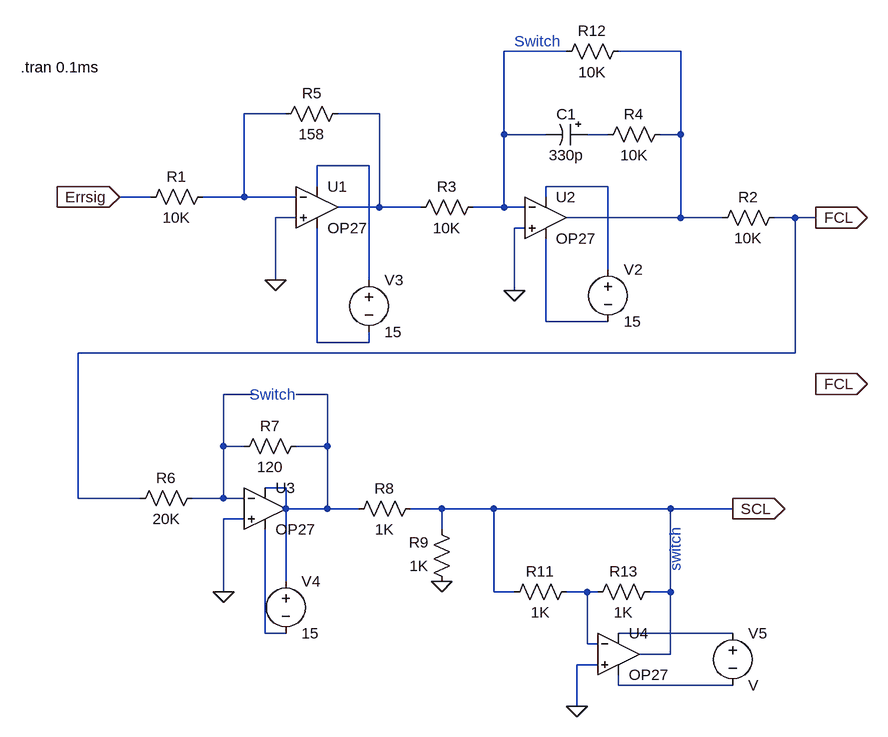
[diagram p0: schematic PID controller.asc]
PID controller.asc, the LTspice schematic file:
Version 4
SHEET 1 1340 1136
WIRE 768 96 672 96
WIRE 944 96 848 96
WIRE 336 192 272 192
WIRE 480 192 416 192
WIRE 672 224 672 96
WIRE 736 224 672 224
WIRE 832 224 800 224
WIRE 944 224 944 96
WIRE 944 224 912 224
WIRE 464 272 384 272
WIRE 384 304 384 272
WIRE 832 304 736 304
WIRE 128 320 80 320
WIRE 272 320 272 192
WIRE 272 320 208 320
WIRE 352 320 272 320
WIRE 736 320 736 304
WIRE 480 336 480 192
WIRE 480 336 416 336
WIRE 544 336 480 336
WIRE 672 336 672 224
WIRE 672 336 624 336
WIRE 704 336 672 336
WIRE 352 352 320 352
WIRE 944 352 944 224
WIRE 944 352 768 352
WIRE 1008 352 944 352
WIRE 1120 352 1088 352
WIRE 1152 352 1120 352
WIRE 704 368 688 368
WIRE 832 432 832 304
WIRE 320 448 320 352
WIRE 464 448 464 272
WIRE 688 464 688 368
WIRE 736 512 736 384
WIRE 832 512 736 512
WIRE 384 544 384 368
WIRE 464 544 464 528
WIRE 464 544 384 544
WIRE 1120 560 1120 352
WIRE 1120 560 16 560
WIRE 288 624 240 624
WIRE 400 624 352 624
WIRE 240 704 240 624
WIRE 272 704 240 704
WIRE 400 704 400 624
WIRE 400 704 352 704
WIRE 336 768 304 768
WIRE 16 784 16 560
WIRE 112 784 16 784
WIRE 240 784 240 704
WIRE 240 784 192 784
WIRE 272 784 240 784
WIRE 336 800 336 768
WIRE 400 800 400 704
WIRE 400 800 336 800
WIRE 448 800 400 800
WIRE 576 800 528 800
WIRE 656 800 576 800
WIRE 928 800 656 800
WIRE 1024 800 928 800
WIRE 272 816 240 816
WIRE 576 832 576 800
WIRE 336 912 336 800
WIRE 240 928 240 816
WIRE 656 928 656 800
WIRE 688 928 656 928
WIRE 800 928 768 928
WIRE 816 928 800 928
WIRE 928 928 928 800
WIRE 928 928 896 928
WIRE 304 992 304 832
WIRE 336 992 304 992
WIRE 1024 992 848 992
WIRE 800 1008 800 928
WIRE 816 1008 800 1008
WIRE 928 1024 928 928
WIRE 928 1024 880 1024
WIRE 816 1040 784 1040
WIRE 848 1072 848 1056
WIRE 1024 1072 848 1072
WIRE 784 1104 784 1040
FLAG 688 464 0
FLAG 320 448 0
FLAG 1152 352 FCL
IOPIN 1152 352 Out
FLAG 240 928 0
FLAG 784 1104 0
FLAG 1024 800 SCL
IOPIN 1024 800 Out
FLAG 576 912 0
FLAG 80 320 Errsig
IOPIN 80 320 In
FLAG 1152 608 FCL
IOPIN 1152 608 Out
SYMBOL res 112 336 R270
WINDOW 0 32 56 VTop 2
WINDOW 3 0 56 VBottom 2
SYMATTR InstName R1
SYMATTR Value 10K
SYMBOL polcap 800 208 R90
WINDOW 0 0 32 VBottom 2
WINDOW 3 32 32 VTop 2
SYMATTR InstName C1
SYMATTR Value 330p
SYMATTR Description Capacitor
SYMATTR Type cap
SYMATTR SpiceLine V=X Rser=900m Lser=0 mfg="   ---" pn="   ---" type="   ---"
SYMBOL res 640 320 R90
WINDOW 0 0 56 VBottom 2
WINDOW 3 32 56 VTop 2
SYMATTR InstName R3
SYMATTR Value 10K
SYMBOL res 928 208 R90
WINDOW 0 0 56 VBottom 2
WINDOW 3 32 56 VTop 2
SYMATTR InstName R4
SYMATTR Value 10K
SYMBOL OpAmps/OP27 736 288 R0
SYMATTR InstName U2
SYMBOL res 432 176 R90
WINDOW 0 0 56 VBottom 2
WINDOW 3 32 56 VTop 2
SYMATTR InstName R5
SYMATTR Value 158
SYMBOL res 1104 336 R90
WINDOW 0 0 56 VBottom 2
WINDOW 3 32 56 VTop 2
SYMATTR InstName R2
SYMATTR Value 10K
SYMBOL voltage 832 416 R0
SYMATTR InstName V2
SYMATTR Value 15
SYMATTR SpiceLine Rser=1
SYMBOL voltage 464 432 R0
SYMATTR InstName V3
SYMATTR Value 15
SYMATTR SpiceLine Rser=1
SYMBOL OpAmps/OP27 384 272 R0
SYMATTR InstName U1
SYMBOL res 208 768 R90
WINDOW 0 0 56 VBottom 2
WINDOW 3 32 56 VTop 2
SYMATTR InstName R6
SYMATTR Value 20K
SYMBOL res 368 688 R90
WINDOW 0 0 56 VBottom 2
WINDOW 3 32 56 VTop 2
SYMATTR InstName R7
SYMATTR Value 120
SYMBOL res 544 784 R90
WINDOW 0 0 56 VBottom 2
WINDOW 3 32 56 VTop 2
SYMATTR InstName R8
SYMATTR Value 1K
SYMBOL res 592 928 R180
WINDOW 0 36 76 Left 2
WINDOW 3 36 40 Left 2
SYMATTR InstName R9
SYMATTR Value 1K
SYMBOL OpAmps/OP27 304 736 R0
SYMATTR InstName U3
SYMBOL OpAmps/OP27 848 960 R0
SYMATTR InstName U4
SYMBOL voltage 336 896 R0
SYMATTR InstName V4
SYMATTR Value 15
SYMBOL voltage 1024 976 R0
SYMATTR InstName V5
SYMBOL res 784 912 R90
WINDOW 0 0 56 VBottom 2
WINDOW 3 32 56 VTop 2
SYMATTR InstName R11
SYMATTR Value 1K
SYMBOL res 864 80 R90
WINDOW 0 0 56 VBottom 2
WINDOW 3 32 56 VTop 2
SYMATTR InstName R12
SYMATTR Value 10K
SYMBOL res 912 912 R90
WINDOW 0 0 56 VBottom 2
WINDOW 3 32 56 VTop 2
SYMATTR InstName R13
SYMATTR Value 1K
TEXT -72 120 Left 2 !.tran 0.1ms
TEXT 688 80 Left 2 ;Switch
TEXT 280 624 Left 2 ;Switch
TEXT 936 896 VLeft 2 ;switch

The netlist it stands for:
* PID controller.asc
R1 Errsig N003 10K
C1 N005 N001 330p V=X Rser=900m Lser=0 mfg="   ---" pn="   ---" type="   ---"
R3 N001 N004 10K
R4 N002 N005 10K
XU2 0 N001 N007 N008 N002 OP27  ; pins In+ In- V+ V- OUT
R5 N004 N003 158
R2 FCL N002 10K
V2 N007 N008 15 Rser=1
V3 N006 N009 15 Rser=1
XU1 0 N003 N006 N009 N004 OP27  ; pins In+ In- V+ V- OUT
R6 N010 FCL 20K
R7 N011 N010 120
R8 SCL N011 1K
R9 0 SCL 1K
XU3 0 N010 N011 N013 N011 OP27  ; pins In+ In- V+ V- OUT
XU4 0 N012 N014 N015 SCL OP27  ; pins In+ In- V+ V- OUT
V4 N011 N013 15
V5 N014 N015 V
R11 N012 SCL 1K
R12 N002 N001 10K
R13 SCL N012 1K
.tran 0.1ms
* Switch
* Switch
* switch
.lib ADI.lib
.backanno
.end